# EasyEDA Pro project CogletESP_2026-02-24.epro, board CogletESPV1.1_3
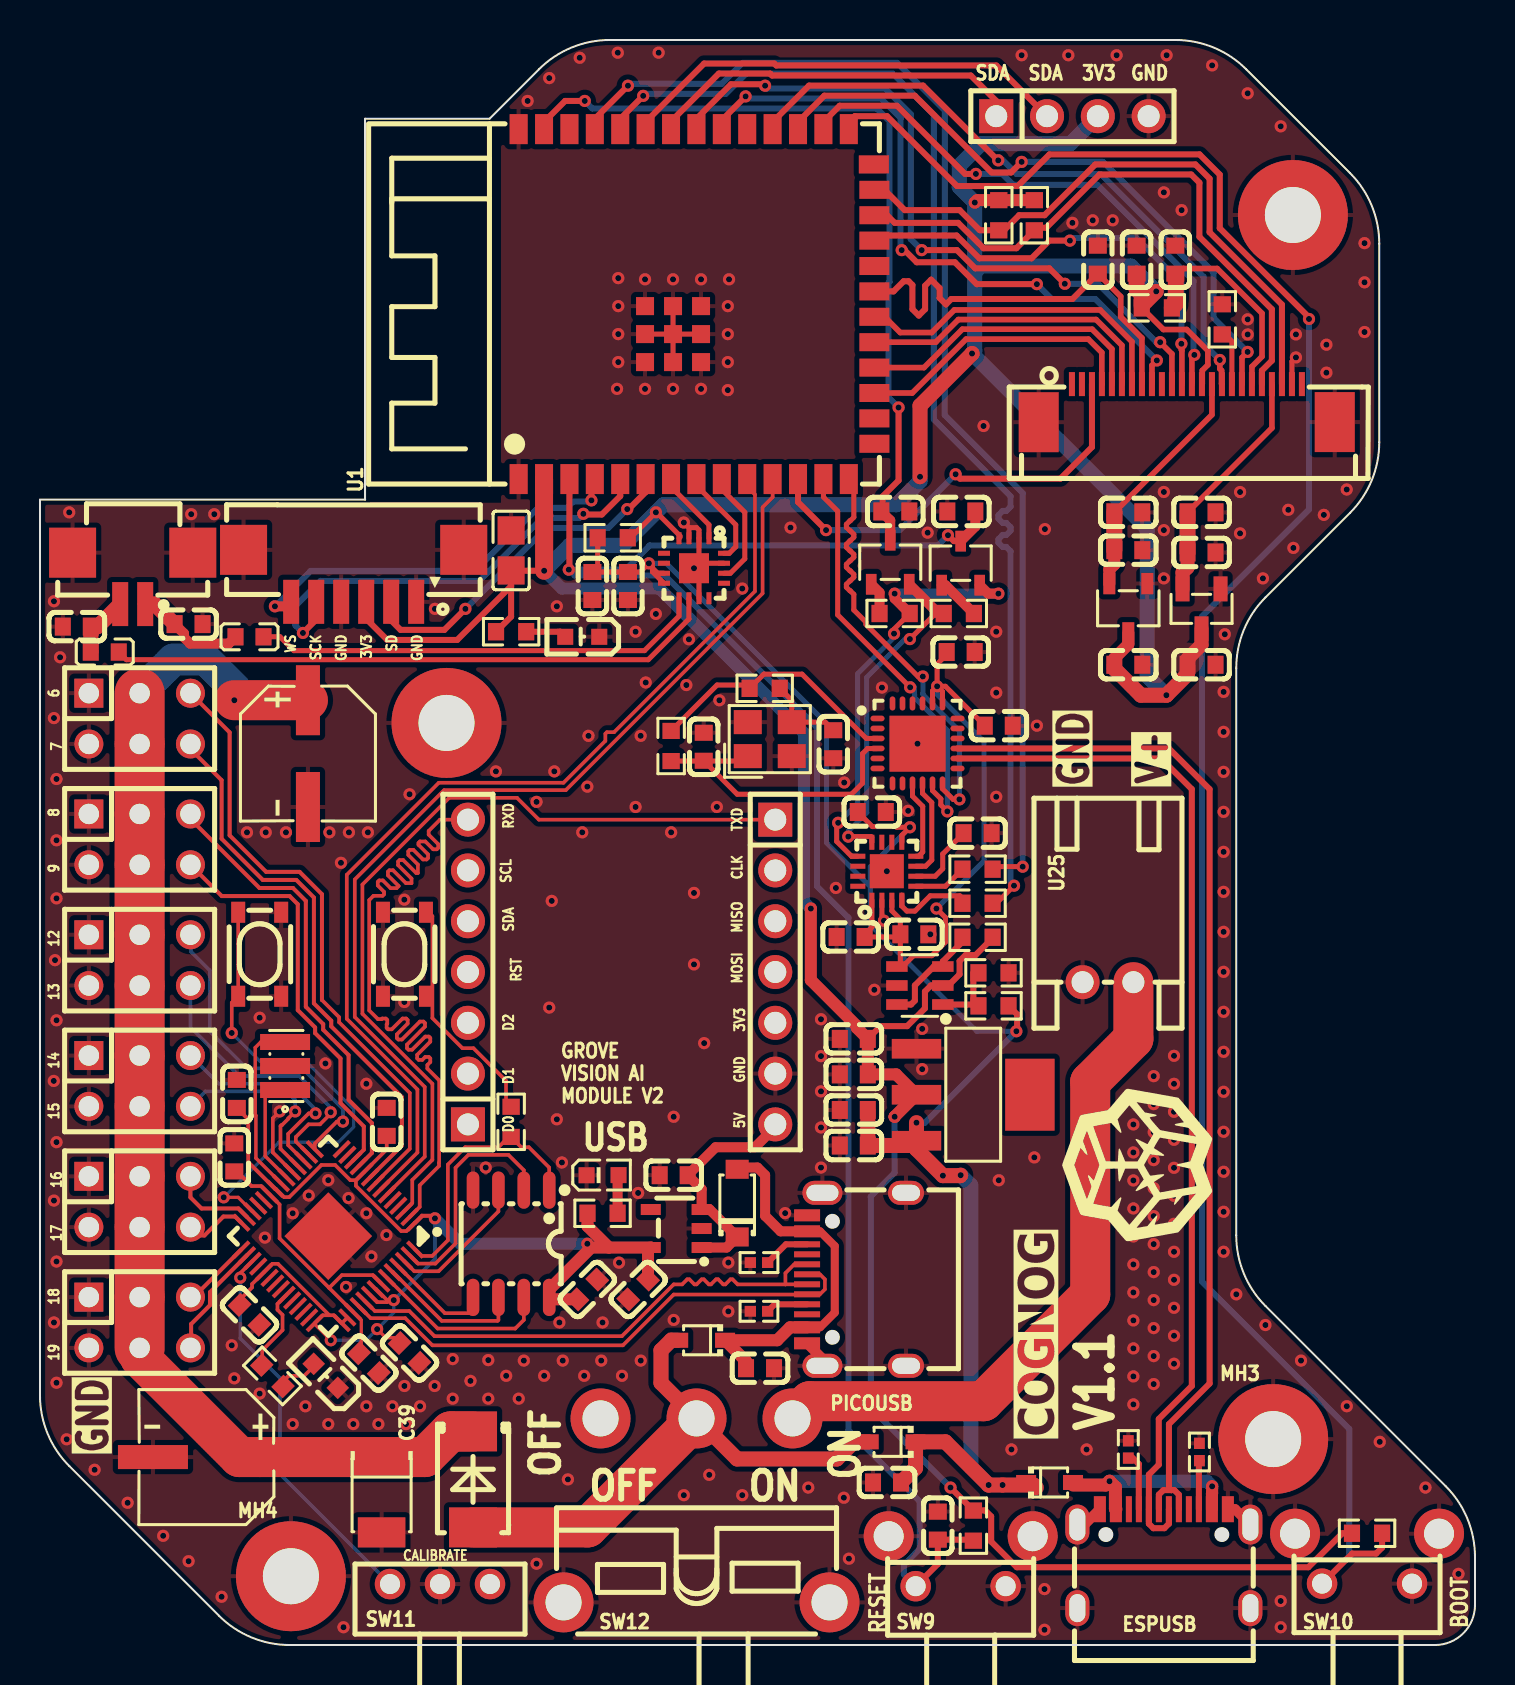
[diagram p11: board, top side]
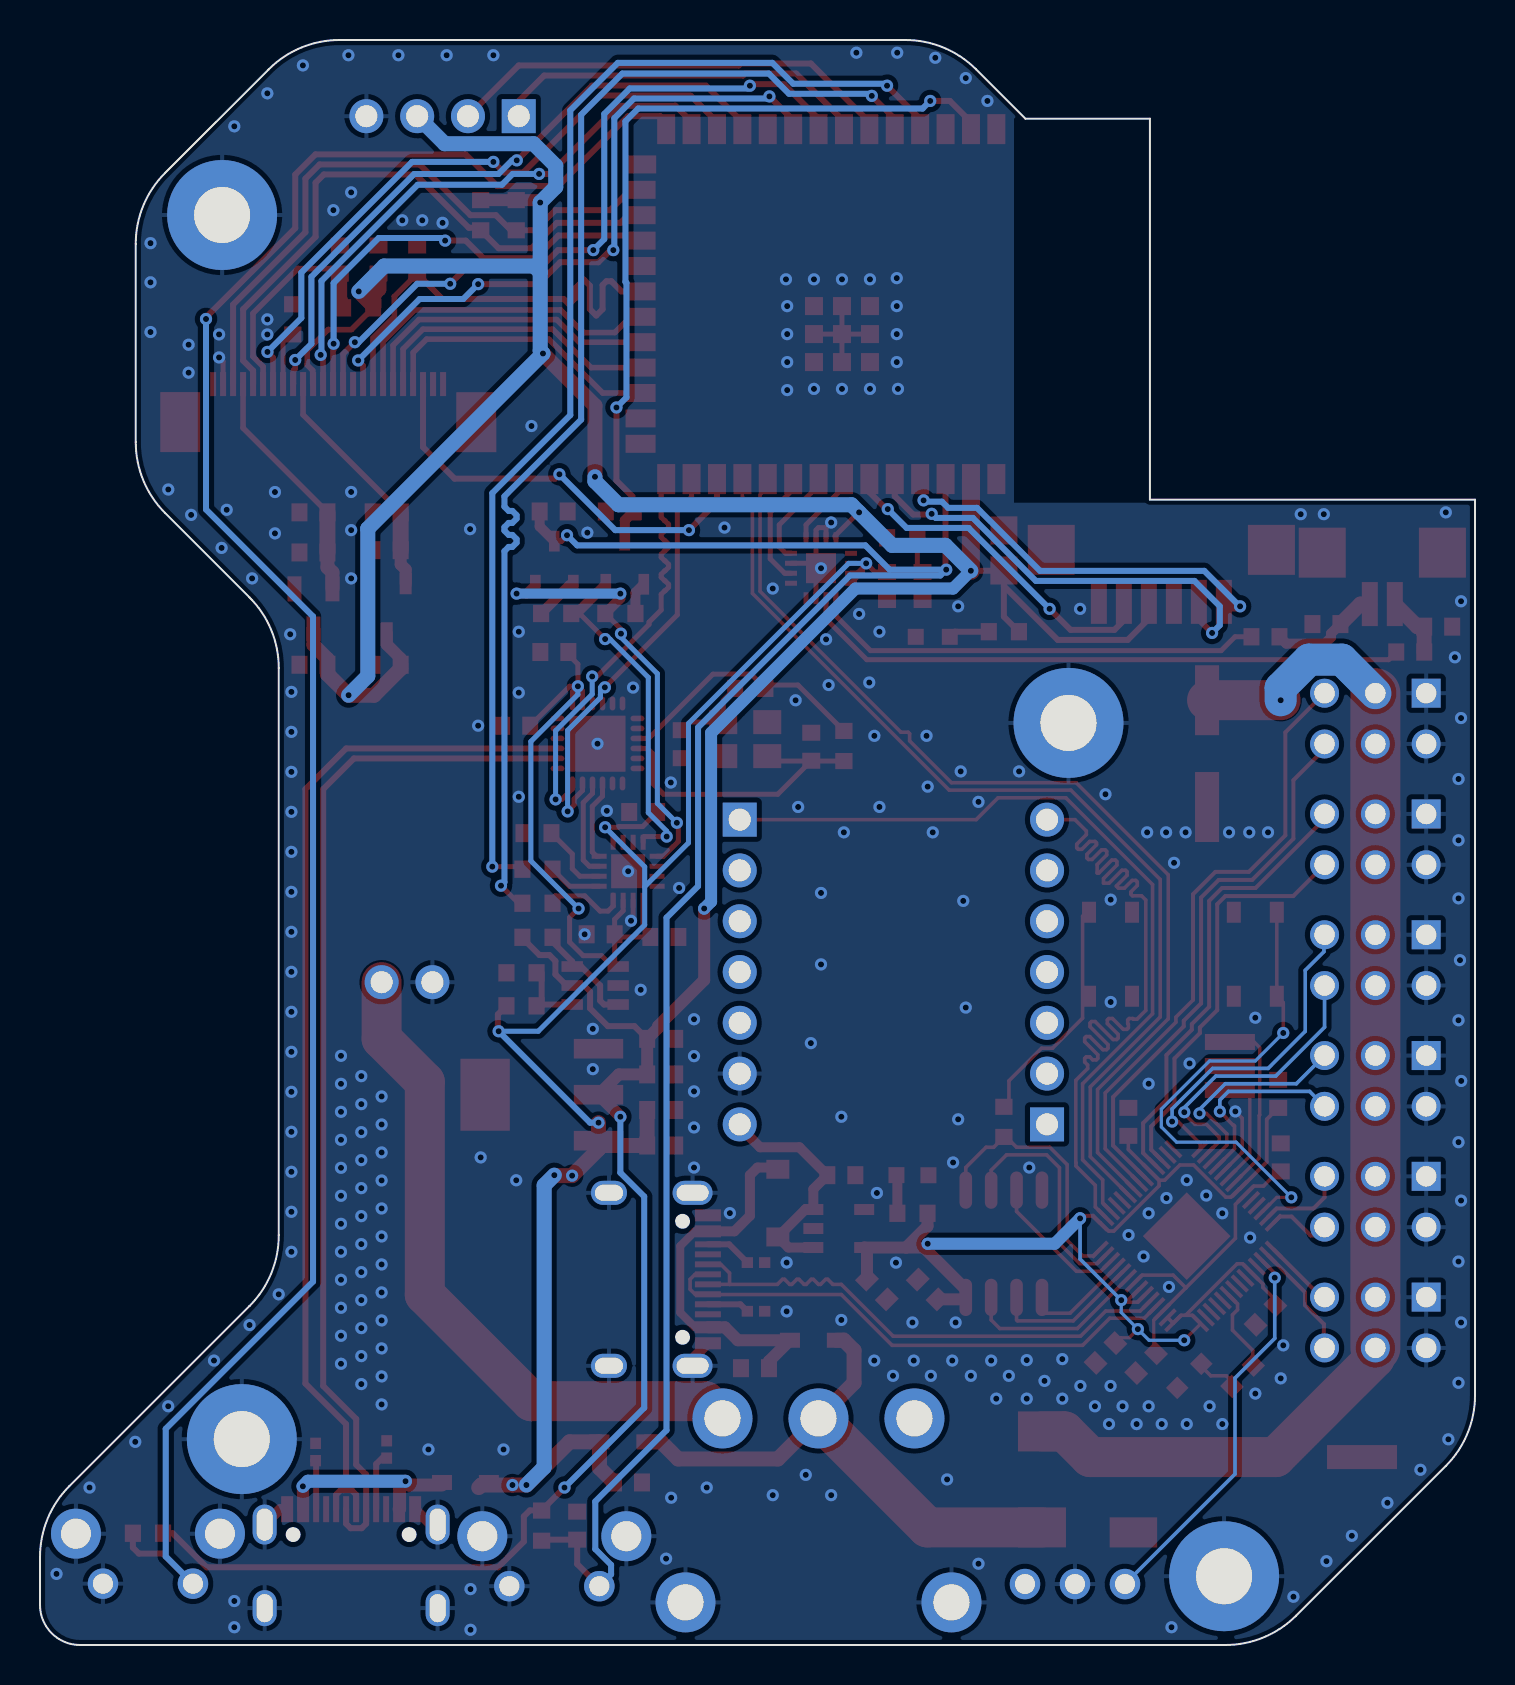
[diagram p12: board, bottom side, seen from below]

Outline 71.76 x 80.26 mm; copper layers: Top Layer, Bottom Layer. Coordinates in mm from the lower left corner of the outline.
Outline path: 0,57.28 16.26,57.28 16.26,76.33 22.48,76.33 24.95,78.8 arc(26.57,79.88) 28.49,80.26 56.78,80.26 arc(58.69,79.88) 60.31,78.8 65.5,73.61 arc(66.59,71.99) 66.97,70.08 66.97,60.15 arc(66.59,58.24) 65.5,56.61 61.28,52.39 arc(60.2,50.77) 59.82,48.86 59.82,20.49 arc(60.2,18.57) 61.28,16.95 70.29,7.94 arc(71.37,6.32) 71.76,4.41 71.76,2 arc(71.17,0.59) 69.76,0 12.48,0 arc(10.57,0.38) 8.95,1.46 1.46,8.95 arc(0.38,10.57) 0,12.48 0,57.28
Stack: Top Layer 0.07mm / Dielectric1 1.51mm FR4 er 4.5 / Bottom Layer 0.07mm

## Design rules (mm)
net EIORX: DP10
net EIOTX: DP10
net EIO17: DP5
net EIO18: DP5
net EIO19: DP9
net EIO20: DP9
net USB_DM: DP1
net USB_DP: DP1
net D_N: DP3
net D_P: DP3
net GPIO0: DP6
net GPIO1: DP6
net CAMPCLK: DP8
net CAMXCLK: DP8
template: Custom Config
spacing copperThickness1oz: track to track 0.102, other pairs 0.152 to 0.3
spacing copperThickness2oz (default): track to track 0.203, other pairs 0.152 to 0.3
track width copperThickness1oz: min 0.127, default 0.254, max 2.54
track width copperThickness2oz (default): min 0.16, default 0.254, max 2.54
differential pair differentialPair (default): width min 0.127, default 0.254, max 2.54; gap min 0.16, default 0.16
via viaSize (default): diameter min 0.5, default 0.61, max 10; hole min 0.3, default 0.305, max 6.3

## Placement (name value [footprint] x y rotation side)
C1  1uF  [C0603]  31.69 23.49 0 top
C2  10uF  [C0603]  42.35 8.13 0 top
C3  220uF  [CAP-SMD_BD6.3-L6.6-W6.6-FD]  8.32 9.4 180 top
C4  1uF  [C0603]  9.84 27.56 270 top
C5  1uF  [C0603]  9.72 24.38 270 top
C6  100nF  [C0603]  18.48 14.6 135 top
C7  100nF  [C0603]  10.48 16.51 135 top
C8  100nF  [C0603]  17.34 26.16 270 top
C9  100nF  [C0603]  16.45 14.1 135 top
C10  10uF  [C0603]  36 13.84 180 top
C11  1uF  [C0603]  29.91 17.78 45 top
C12  1uF  [C0603]  27.37 17.78 225 top
C13  10uF  [C0805]  23.56 54.74 270 top
C14  1uF  [C0603]  44.89 5.97 270 top
C16  1uF  [C0603]  47.94 45.97 180 top
C17  1uF  [C0603]  46.04 49.66 180 top
C18  15pF  [C0603]  33.19 44.92 90 top
C19  15pF  [C0603]  39.67 45.05 270 top
C21  220uF  [CAP-SMD_BD6.3-L6.6-W6.6-FD]  13.4 44.58 270 top
C22  100nF  [C0603]  40.54 35.41 180 top
C23  100nF  [C0603]  43.72 35.54 180 top
C24  100nF  [C0603]  46.88 40.6 180 top
C25  4.7uF  [C0603]  46.07 56.69 0 top
C26  1uF  [C0603]  42.77 56.69 180 top
C27  100nF  [C0603]  40.69 24.98 0 top
C30  100nF  [C0603]  40.69 28.53 0 top
C32  10uF  [C0603]  40.69 26.76 0 top
C33  10uF  [C0603]  40.69 30.31 0 top
C34  10uF  [C0603]  41.59 41.66 180 top
C35  10uF  [C0603]  29.4 52.96 90 top
C36  100nF  [C0603]  27.62 52.96 90 top
C37  220pF  [C0603]  1.84 50.93 0 top
C38  220pF  [C0603]  7.43 51.05 180 top
C39  220uF  [CASE-B_3528]  17.08 7.49 270 top
C40  15pF  [C0603]  52.9 69.28 270 top
C41  100nF  [C0603]  54.83 69.28 270 top
C42  100nF  [C0603]  56.77 69.28 270 top
C43  100nF  [C0603]  58.08 56.64 180 top
C44  10uF  [C0603]  58.08 54.64 180 top
C45  100nF  [C0603]  58.08 49.02 180 top
C46  100nF  [C0603]  54.42 54.75 0 top
C47  10uF  [C0603]  54.42 56.64 0 top
C48  10uF  [C0603]  54.42 49.02 0 top
CN1  HC-1.25-2PWT  [CONN-SMD_2P-P1.25-HC-1.25-2PWT]  4.64 53.34 180 top
CN4  HC-1.25-6PWT  [CONN-SMD_6P-P1.25_HC-1.25-6PWT]  15.68 53.47 180 top
D1  DSK34  [SOD-123_L2.8-W1.8-LS3.7-RD]  34.86 22.1 90 top
D2  B5819WS  [SOD-323_L1.8-W1.3-LS2.5-RD]  42.61 10.16 180 top
D3  B5819WS  [SOD-323_L1.8-W1.3-LS2.5-RD]  50.48 8.13 0 top
D6  B5819WS  [SOD-323_L1.8-W1.3-LS2.5-RD]  33.08 15.24 180 top
D7  SS1045-SMB  [SMB_L4.4-W3.6-LS5.3-RD]  21.65 8.28 270 top
ESPUSB  TYPE-C-31-M-12  [USB-C_SMD-TYPE-C-31-M-12_1]  56.2 4.32 0 top
FPC3  AFC07-S24FCA-00  [FPC-SMD_AFC07-S24FCA-00]  57.34 62.1 0 top
H8  PZ254V-11-04P  [HDR-TH_4P-P2.54-V-M]  51.63 76.45 0 top
L1  BLM18PG121SN1D  [L0603]  10.48 50.42 0 top
L2  BLM18PG121SN1D  [L0603]  3.24 49.66 0 top
LED1  SML-D12P8WT86  [LED0603-RD_GREEN]  28.13 23.49 0 top
LED2  SML-D12D8WT86  [LED0603-R-RD_AMBER]  14.29 13.46 135 top
LED3  SML-D12D8WT86  [LED0603-R-RD_AMBER]  27.11 50.42 180 top
MH1  -  [2.5mm Mounting Hole]  20.33 46.11 0 top
MH2  -  [2.5mm Mounting Hole]  62.65 71.51 0 top
MH3  -  [2.5mm Mounting Hole]  61.66 10.3 0 top
MH4  -  [2.5mm Mounting Hole]  12.55 3.44 0 top
PICOUSB  TYPE-C-31-M-12  [USB-C_SMD-TYPE-C-31-M-12_1]  40.83 18.29 90 top
Q1  FDC6333C  [SOT-23-6_L2.9-W1.6-P0.95-LS2.8-BL]  44 32.98 90 top
Q2  S8050  [SOT-23-3_L3.0-W1.7-P0.95-LS2.9-BR]  42.52 54.15 270 top
Q3  S8050  [SOT-23-3_L3.0-W1.7-P0.95-LS2.9-BR]  46.04 54.1 270 top
R7  1kΩ  [R0603]  11.62 13.46 135 top
R8  1kΩ  [R0603]  28.13 21.59 180 top
R9  1kΩ  [R0603]  23.56 26.16 270 top
R11  5.1kΩ  [R0402]  35.95 16.69 0 top
R12  5.1kΩ  [R0402]  35.95 19.12 0 top
R13  10kΩ  [R0603]  46.67 5.97 90 top
R14  10kΩ  [R0603]  66.36 5.59 180 top
R15  100kΩ  [R0603]  47.68 31.96 180 top
R16  100kΩ  [R0603]  47.68 33.61 0 top
R17  100kΩ  [R0603]  46.88 35.39 180 top
R18  1kΩ  [R0603]  36.24 47.84 180 top
R19  1kΩ  [R0603]  31.56 44.96 270 top
R21  10kΩ  [R0603]  23.56 50.67 180 top
R22  0Ω  [R0603]  46.88 37.09 180 top
R23  0Ω  [R0603]  46.88 38.8 180 top
R24  12kΩ  [R0603]  45.94 51.58 180 top
R25  12kΩ  [R0603]  42.74 51.58 0 top
R26  5.1kΩ  [R0402]  54.42 9.78 270 top
R27  5.1kΩ  [R0402]  57.98 9.65 270 top
R28  1MΩ  [R0603]  28.64 55.37 180 top
R30  4.7kΩ  [R0603]  55.84 66.87 180 top
R31  4.7kΩ  [R0603]  49.72 71.5 90 top
R32  4.7kΩ  [R0603]  47.94 71.5 90 top
R33  1kΩ  [R0603]  59.12 66.29 90 top
SW1  SKRPACE010  [KEY-SMD_4P-L4.2-W3.2-P2.20-LS4.6]  18.22 34.54 270 top
SW2  SKRPACE010  [KEY-SMD_4P-L4.2-W3.2-P2.20-LS4.6]  10.99 34.54 90 top
SW9  TC-6615-9.5-260G  [SW-TH_4P-L7.5-W9.5-P4.50]  46.04 4.19 180 top
SW10  TC-6615-9.5-260G  [SW-TH_4P-L7.5-W9.5-P4.50]  66.36 4.32 180 top
SW11  MK-12D13G4-B  [SW-TH_MK-12D13G4-B]  20 3.05 0 top
SW12  SS-12D11G5R  [SW-TH_SS-12D11G5R]  32.83 6.73 180 top
U1  ESP32-S3-WROOM-1-N16R8  [WIRELM-SMD_ESP32-S3-WROOM-1]  32.83 67.06 90 top
U2  HX PZ2.54-3x2P ZZ  [HDR-TH_6P-P2.54-V-M-R3-C2-S2.54_2]  4.98 40.29 270 top
U4  HX PZ2.54-3x2P ZZ  [HDR-TH_6P-P2.54-V-M-R3-C2-S2.54_2]  4.98 28.21 270 top
U5  HX PZ2.54-3x2P ZZ  [HDR-TH_6P-P2.54-V-M-R3-C2-S2.54_2]  4.98 34.25 270 top
U6  W25Q16JVSNIQ  [SOP-8_L4.9-W3.9-P1.27-LS6.0-BL]  23.56 20.07 180 top
U7  RP2040  [LQFN-56_L7.0-W7.0-P0.4-EP]  14.41 20.45 225 top
U8  MIC5504-3.3YM5-TR  [SOT-23-5_L3.0-W1.7-P0.95-LS2.8-TL]  31.81 20.83 180 top
U11  CH334F  [QFN-24_L4.0-W4.0-P0.50-BL-EP2.8]  43.88 45.08 270 top
U12  12MHz  [CRYSTAL-SMD_4P-L3.2-W2.5-BL]  36.49 45.3 0 top
U14  CH343P  [TQFN-16_L3.0-W3.0-P0.50-BL-EP1.7]  42.34 38.69 0 top
U15  AMS1117-3.3  [SOT-223-4_L6.5-W3.5-P2.30-LS7.0-BR]  46.66 27.52 180 top
U16  MAX98357AETE+T  [TQFN-16_L3.0-W3.0-P0.50-BL-EP1.5]  32.7 53.85 180 top
U18  HB-PH3-25417PB2GOP  [HDR-TH_7P-P2.54-V-M]  21.4 33.65 90 top
U20  HB-PH3-25417PB2GOP  [HDR-TH_7P-P2.54-V-M]  36.77 33.65 270 top
U22  HX PZ2.54-3x2P ZZ  [HDR-TH_6P-P2.54-V-M-R3-C2-S2.54_2]  4.98 46.33 270 top
U23  HX PZ2.54-3x2P ZZ  [HDR-TH_6P-P2.54-V-M-R3-C2-S2.54_2]  4.98 16.13 270 top
U24  HX PZ2.54-3x2P ZZ  [HDR-TH_6P-P2.54-V-M-R3-C2-S2.54_2]  4.98 22.17 270 top
U25  S2B-XH-A-BK(LF)(SN)  [CONN-TH_S2B-XH-A-LF-SN]  53.4 33.15 0 top
U26  XC6206P282MR  [SOT-23-3_L2.9-W1.3-P0.95-LS2.4-BR]  58.08 51.82 90 top
U28  SSP7615-12MR  [SOT-23-3_L2.9-W1.6-P1.90-LS2.8-BR]  54.42 51.85 90 top
X1  12MHz  [CRYSTAL-SMD_3P-L3.2-W1.3-P1.2-BL]  12.26 28.96 90 top

## Footprints (pads in the part's own frame, mm; a bottom-side part is the same pattern mirrored in y, then rotated)
2.5mm Mounting Hole
  round 5.5 hole 2.8: 1(0,0)
C0603
  rect 0.8x0.9 smd: 1(-0.7,0) 2(0.7,0)
C0805
  rect 1.41x1.35 smd: 1(-1,0) 2(1,0)
CAP-SMD_BD6.3-L6.6-W6.6-FD
  rect 3.5x1.2 smd: 1(-2.67,0) 2(2.67,0)
CASE-B_3528
  rect 1.506x2.376 smd: 1(-1.861,0) 2(1.861,0)
CONN-SMD_2P-P1.25-HC-1.25-2PWT
  rect 0.8x2.2 smd: 1(-0.625,1.285) 2(0.625,1.285)
  rect 2.35x2.5 smd: 3(-3.005,-1.285) 4(3.005,-1.285)
CONN-SMD_6P-P1.25_HC-1.25-6PWT
  rect 0.8x2.2 smd: 1(-3.125,1.3) 2(-1.875,1.3) 3(-0.625,1.3) 4(0.625,1.3) 5(1.875,1.3) 6(3.125,1.3)
  rect 2.35x2.5 smd: 7(-5.505,-1.3) 8(5.505,-1.3)
CONN-TH_S2B-XH-A-LF-SN
  round 1.7 hole 1.1: 1(1.27,0) 2(-1.27,0)
CRYSTAL-SMD_3P-L3.2-W1.3-P1.2-BL
  rect 0.8x2.5 smd: 1(-1.2,0) 2(0,0) 3(1.2,0)
CRYSTAL-SMD_4P-L3.2-W2.5-BL
  rect 1.4x1.2 smd: 1(-1.1,-0.85) 2(1.1,-0.85) 3(1.1,0.85) 4(-1.1,0.85)
FPC-SMD_AFC07-S24FCA-00
  rect 0.3x1.2 smd: 1(-5.74,0.953) 2(-5.239,0.953) 3(-4.739,0.953) 4(-4.242,0.953) 5(-3.741,0.953) 6(-3.24,0.953) 7(-2.74,0.953) 8(-2.24,0.953) 9(-1.74,0.953) 10(-1.24,0.953) 11(-0.74,0.953) 12(-0.241,0.953) 13(0.26,0.953) 14(0.76,0.953) 15(1.26,0.953) 16(1.76,0.953) 17(2.26,0.953) 18(2.759,0.953) 19(3.26,0.953) 20(3.76,0.953) 21(4.26,0.953) 22(4.761,0.953) 23(5.261,0.953) 24(5.76,0.953)
  rect 2x3 smd: 25(-7.401,-0.953) 26(7.401,-0.947)
HDR-TH_4P-P2.54-V-M
  rect 1.7x1.7 hole 1.1: 1(-3.81,0)
  round 1.7 hole 1.1: 2(-1.27,0) 3(1.27,0) 4(3.81,0)
HDR-TH_6P-P2.54-V-M-R3-C2-S2.54_2
  round 1.45 hole 1.02: 1(1.27,2.54) 2(-1.27,2.54) 3(-1.27,0) 4(1.27,0) 5(1.27,-2.54)
  rect 1.45x1.45 hole 1.02: 6(-1.27,-2.54)
HDR-TH_7P-P2.54-V-M
  rect 1.7x1.7 hole 1.1: 1(-7.62,0)
  round 1.7 hole 1.1: 2(-5.08,0) 3(-2.54,0) 4(0,0) 5(2.54,0) 6(5.08,0) 7(7.62,0)
KEY-SMD_4P-L4.2-W3.2-P2.20-LS4.6
  rect 1.05x0.7 smd: 1(-2.1,1.075) 2(2.1,1.075) 3(-2.1,-1.075) 4(2.1,-1.075)
L0603
  rect 0.8x0.864 smd: 1(-0.7,0) 2(0.7,0)
LED0603-R-RD_AMBER
  rect 0.8x0.8 smd: 1(0.851,0) 2(-0.851,0)
LED0603-RD_GREEN
  rect 0.8x0.8 smd: 1(-0.799,-0.004) 2(0.799,0.004)
LQFN-56_L7.0-W7.0-P0.4-EP
  rect 1.1x0.2 smd: 1(-3.55,2.6) 2(-3.55,2.2) 3(-3.55,1.8) 4(-3.55,1.4) 5(-3.55,1) 6(-3.55,0.6) 7(-3.55,0.2) 8(-3.55,-0.2) 9(-3.55,-0.6) 10(-3.55,-1) 11(-3.55,-1.4) 12(-3.55,-1.8) 13(-3.55,-2.2) 14(-3.55,-2.6) 29(3.55,-2.6) 30(3.55,-2.2) 31(3.55,-1.8) 32(3.55,-1.4) 33(3.55,-1) 34(3.55,-0.6) 35(3.55,-0.2) 36(3.55,0.2) 37(3.55,0.6) 38(3.55,1) 39(3.55,1.4) 40(3.55,1.8) 41(3.55,2.2) 42(3.55,2.6)
  rect 0.2x1.1 smd: 15(-2.6,-3.55) 16(-2.2,-3.55) 17(-1.8,-3.55) 18(-1.4,-3.55) 19(-1,-3.55) 20(-0.6,-3.55) 21(-0.2,-3.55) 22(0.2,-3.55) 23(0.6,-3.55) 24(1,-3.55) 25(1.4,-3.55) 26(1.8,-3.55) 27(2.2,-3.55) 28(2.6,-3.55) 43(2.6,3.55) 44(2.2,3.55) 45(1.8,3.55) 46(1.4,3.55) 47(1,3.55) 48(0.6,3.55) 49(0.2,3.55) 50(-0.2,3.55) 51(-0.6,3.55) 52(-1,3.55) 53(-1.4,3.55) 54(-1.8,3.55) 55(-2.2,3.55) 56(-2.6,3.55)
  rect 3.1x3.1 smd: 57(0,0)
QFN-24_L4.0-W4.0-P0.50-BL-EP2.8
  oval 0.28x0.7 smd: 1(-1.25,-2) 2(-0.75,-2) 3(-0.25,-2) 4(0.25,-2) 5(0.75,-2) 6(1.25,-2) 13(1.25,2) 14(0.75,2) 15(0.25,2) 16(-0.25,2) 17(-0.75,2) 18(-1.25,2)
  oval 0.7x0.28 smd: 7(2,-1.25) 8(2,-0.75) 9(2,-0.25) 10(2,0.25) 11(2,0.75) 12(2,1.25) 19(-2,1.25) 20(-2,0.75) 21(-2,0.25) 22(-2,-0.25) 23(-2,-0.75) 24(-2,-1.25)
  rect 2.8x2.8 smd: 25(0.013,0)
R0402
  rect 0.566x0.54 smd: 1(-0.433,0) 2(0.433,0)
R0603
  rect 0.806x0.864 smd: 1(-0.753,0) 2(0.753,0)
SMB_L4.4-W3.6-LS5.3-RD
  rect 2x2.4 smd: 1(-2.4,0) 2(2.4,0)
SOD-123_L2.8-W1.8-LS3.7-RD
  rect 0.95x1.15 smd: 1(-1.692,0) 2(1.692,0)
SOD-323_L1.8-W1.3-LS2.5-RD
  rect 1x0.75 smd: 1(-1.173,0) 2(1.173,0)
SOP-8_L4.9-W3.9-P1.27-LS6.0-BL
  oval 0.63x1.865 smd: 1(-1.905,-2.683) 2(-0.635,-2.683) 3(0.635,-2.683) 4(1.905,-2.683) 5(1.905,2.683) 6(0.635,2.683) 7(-0.635,2.683) 8(-1.905,2.683)
SOT-23-3_L2.9-W1.3-P0.95-LS2.4-BR
  rect 1.25x0.7 smd: 1(1,-0.95) 2(1,0.95) 3(-1,0)
SOT-23-3_L2.9-W1.6-P1.90-LS2.8-BR
  rect 1.07x0.6 smd: 1(1.235,-0.95) 2(1.235,0.95) 3(-1.235,0)
SOT-23-3_L3.0-W1.7-P0.95-LS2.9-BR
  rect 1.038x0.532 smd: 1(1.101,-0.95) 2(1.101,0.95) 3(-1.101,0)
SOT-23-5_L3.0-W1.7-P0.95-LS2.8-TL
  rect 1x0.55 smd: 1(-1.272,0.95) 2(-1.272,0) 3(-1.272,-0.95) 4(1.272,-0.95) 5(1.272,0.95)
SOT-23-6_L2.9-W1.6-P0.95-LS2.8-BL
  rect 0.532x1.072 smd: 1(-0.95,-1.149) 2(0,-1.149) 3(0.95,-1.149) 4(0.95,1.149) 5(0,1.149) 6(-0.95,1.149)
SOT-223-4_L6.5-W3.5-P2.30-LS7.0-BR
  rect 2.47x0.98 smd: 1(2.835,-2.3) 2(2.835,0) 3(2.835,2.3)
  rect 2.47x3.6 smd: 4(-2.835,0)
SW-TH_4P-L7.5-W9.5-P4.50
  round 1.524 hole 1: 1(-2.25,1.25) 2(2.25,1.25)
  round 2.5 hole 1.5: 3(-3.6,-1.25) 4(3.6,-1.25)
SW-TH_MK-12D13G4-B
  round 1.524 hole 1: 1(-2.5,0) 2(0,0) 3(2.5,0)
SW-TH_SS-12D11G5R
  round 3 hole 1.8: 1(-4.8,-4.6) 2(0,-4.6) 3(4.8,-4.6) 4(6.65,4.6) 5(-6.65,4.6)
TQFN-16_L3.0-W3.0-P0.50-BL-EP1.5
  rect 0.25x0.6 smd: 1(-0.749,-1.5) 2(-0.248,-1.5) 3(0.252,-1.5) 4(0.751,-1.5) 9(0.75,1.5) 10(0.25,1.5) 11(-0.25,1.5) 12(-0.749,1.5)
  rect 0.6x0.25 smd: 5(1.5,-0.748) 6(1.5,-0.248) 7(1.5,0.252) 8(1.5,0.752) 13(-1.5,0.752) 14(-1.5,0.252) 15(-1.5,-0.248) 16(-1.5,-0.748)
  rect 1.5x1.5 smd: 17(0,0)
TQFN-16_L3.0-W3.0-P0.50-BL-EP1.7
  rect 0.25x0.75 smd: 1(-0.749,-1.45) 2(-0.248,-1.45) 3(0.252,-1.45) 4(0.751,-1.45) 9(0.75,1.45) 10(0.25,1.45) 11(-0.25,1.45) 12(-0.749,1.45)
  rect 0.75x0.25 smd: 5(1.45,-0.75) 6(1.45,-0.25) 7(1.45,0.25) 8(1.45,0.75) 13(-1.45,0.75) 14(-1.45,0.25) 15(-1.45,-0.25) 16(-1.45,-0.75)
  rect 1.7x1.7 smd: 17(0.001,0)
USB-C_SMD-TYPE-C-31-M-12_1
  oval 1.2x2 hole 0.8x1.6: 1(4.325,1.706) 4(-4.325,1.706)
  oval 1.2x1.8 hole 0.8x1.4: 2(4.325,-2.474) 3(-4.325,-2.474)
  custom 0.6x1.3 smd: A1B12(-3.2,2.474) A4B9(-2.4,2.474) B1A12(3.2,2.474) B4A9(2.401,2.474)
  rect 0.3x1.3 smd: A5(-1.25,2.474) A6(-0.25,2.474) A7(0.25,2.474) A8(1.25,2.474) B5(1.75,2.474) B6(0.75,2.474) B7(-0.75,2.474) B8(-1.75,2.474)
WIRELM-SMD_ESP32-S3-WROOM-1
  rect 1.5x0.9 smd: 1(-8.75,8.895) 2(-8.75,7.625) 3(-8.75,6.355) 4(-8.75,5.085) 5(-8.75,3.815) 6(-8.75,2.545) 7(-8.75,1.275) 8(-8.75,0.005) 9(-8.75,-1.265) 10(-8.75,-2.535) 11(-8.75,-3.805) 12(-8.75,-5.075) 13(-8.75,-6.345) 14(-8.75,-7.615) 27(8.75,-7.615) 28(8.75,-6.345) 29(8.75,-5.075) 30(8.75,-3.805) 31(8.75,-2.535) 32(8.75,-1.265) 33(8.75,0.005) 34(8.75,1.275) 35(8.75,2.545) 36(8.75,3.815) 37(8.75,5.085) 38(8.75,6.355) 39(8.75,7.625) 40(8.75,8.895)
  rect 0.9x1.5 smd: 15(-6.985,-8.895) 16(-5.715,-8.895) 17(-4.445,-8.895) 18(-3.175,-8.895) 19(-1.905,-8.895) 20(-0.635,-8.895) 21(0.635,-8.895) 22(1.905,-8.895) 23(3.175,-8.895) 24(4.445,-8.895) 25(5.715,-8.895) 26(6.985,-8.865)
  rect 0.9x0.9 smd: 41(-2.9,2.575) 41(-2.9,1.175) 41(-2.9,-0.225) 41(-1.5,2.575) 41(-1.5,1.175) 41(-1.5,-0.225) 41(-0.1,2.575) 41(-0.1,1.175) 41(-0.1,-0.225)

## Nets
As in the schematic.

Pads without a net: ESPUSB A8 B8; FPC3 1 2 24; PICOUSB A8 B8; SW11 3; SW12 3; U7 35 36 41; U8 4; U11 1 2 5 6 7 8 13 16 17 18 21 22 23 24; U14 10 11 14 15 16; U15 4; U16 5 6 12 13

## Via types
v1: diameter 0.61, hole 0.305, Top Layer to Bottom Layer, 342 vias

## Routing (per net, layer and track width the routed paths; a pad name or vN(x,y) marks a point on that pad's centre or on a via; arc(x,y) is an arc through that point)
1.2V: length 12.1
  Top Layer w0.28: C47.1 58.6,61.52 FPC3.15
  Top Layer w0.6: C46.1 53.72,54.04 53.47,53.79 U28.2
  Top Layer w0.8: C46.1 C47.1
1V1: length 14.9
  Top Layer w0.16: U7.45 16.07,16.25 16.07,14.92 15.95,14.81 15.95,14.72
  Top Layer w0.18: 14.46,17.86 11.98,20.34 11.98,22.03 U7.23 11.06,22.95 10.57,22.95 9.84,23.68 ; 14.46,17.86 15.1,18.5 16.65,18.5 17.07,18.08 ; 14.46,17.86 U7.45
2.8V: length 12.1
  Top Layer w0.28: FPC3.21 61.6,60.86 C43.2
  Top Layer w0.7: U26.2 57.13,53.64 57.38,53.89 C44.2
  Top Layer w0.8: C43.2 C44.2
3V3: length 60.8
  Top Layer w0.16: v1(16.86,15.8) 17.29,15.37 17.72,15.37 C6.2 ; 13.74,16.1 13.74,16.04 v1(14.54,15.24)
  Top Layer w0.18: U7.48 16.87,17.14 17.36,17.14 17.36,17.25 ; 17.36,17.25 16.81,17.8 U7.49 ; 17.36,17.25 v1(17.69,17.25) ; 9.98,17.26 10.6,17.88 10.6,18.05 U7.33 11.62,19.06 11.9,19.06 14.45,16.51 14.45,16.49 ; U7.22 11.79,22.82 12.21,22.4 12.46,22.4 14.07,24 14.76,24 15.52,23.25 15.8,23.25 ; C8.2 17.34,24.78 U7.10 15.8,23.25 ; 14.45,16.49 14.69,16.49 15.09,16.1 15.1,16.1 15.37,16.37 U7.44 ; 14.45,16.49 14.14,16.49 U7.42 ; 15.8,23.25 15.8,22.96 18.06,20.7 18.32,20.7 18.74,21.12 U7.1
  Top Layer w0.19: C4.2 10.41,26.29 10.41,24.15 11.75,22.82 U7.22
  Top Layer w0.2: U7.1 19.11,21.46 19.62,21.46 v1(19.75,21.34)
  Top Layer w0.6: 28.45,19.88 27.56,19.88 25.46,17.78 U6.8 25.56,17.28 C12.2 ; 28.45,19.88 U8.5 30.4,19.74 C11.2 ; 28.45,19.88 27.38,20.95 R8.2
  Bottom Layer w0.16: v1(17.69,17.25) 17.69,16.63 v1(16.86,15.8) 16.3,15.24 v1(14.54,15.24)
  Bottom Layer w0.18: v1(19.75,21.34) 19.75,19.3 v1(17.69,17.25)
  Bottom Layer w0.6: v1(27.37,20.07) 21.02,20.07 v1(19.75,21.34)
3V3_OP: length 32.2
  Top Layer w0.25: 43.02,35.54 43.02,34.1 Q1.4 43.14,33.93 43.68,34.47 44.59,34.47 45.28,35.15 45.28,36.38 v1(44.83,36.83) ; 43.02,35.54 42.89,35.41 C22.1 ; 43.02,35.54 43.02,36.29 42.6,36.71 U14.3 ; U14.1 41.6,35.9 41.24,35.53 ; U11.20 44.63,47.71 v1(44.86,47.94) ; v1(44.86,47.94) 45.13,47.68 U11.19 ; v1(44.86,47.94) 45.27,47.94 C16.2 ; v1(44.86,47.94) 44.86,49.05 45.34,49.53 C17.2
  Bottom Layer w0.25: v1(44.83,36.83) 47.21,39.21 47.21,45.18 44.86,47.53 v1(44.86,47.94)
GND: length 22.3
  Top Layer w0.18: v1(11.98,26.68) 11.64,26.34 11.64,24.63 U7.19
  Top Layer w0.25: U1.41 U1.41 ; U1.41 U1.41 ; U1.41 U1.41 ; U1.41 31.65,66.96 ; 32.45,55.88 v1(32.19,56.13) ; 32.45,55.88 U16.3 ; 32.45,55.88 32.83,55.88 32.95,55.76 U16.2 32.95,54.1 ; v1(42.2,36.22) 42.1,36.33 U14.2 ; 34.2,54.1 32.95,54.1 v1(32.7,53.85) 32.95,53.6 U16.11 ; FPC3.23 62.6,64.19 v1(62.8,64.39)
  Top Layer w0.5: ESPUSB.1 59.75,6.79 ESPUSB.B1A12 ; ESPUSB.A1B12 52.23,6.02 51.87,6.02 ; PICOUSB.4 39.12,14.32 PICOUSB.A1B12
  vias: v1(0.69,28.21) v1(0.7,52.2) v1(0.7,46.35) v1(0.75,34.25) v1(0.7,22.22) v1(0.7,16.13) v1(0.83,43.31) v1(0.83,40.24) v1(0.83,37.34) v1(0.83,31.24) v1(0.83,25.15) v1(0.83,19.18) v1(0.83,13.11) v1(1.01,49.39) v1(1.33,10.29) v1(1.46,56.64) v1(2.73,8.76) v1(4.38,7.11) v1(6.16,5.46) v1(7.43,4.19) v1(7.56,56.55) v1(8.72,56.55) v1(9.08,2.41) v1(9.59,14.99) v1(9.72,13.33) v1(10.35,40.64) v1(10.99,31.37) v1(10.99,12.57) v1(11.29,40.64) v1(11.25,20.37) v1(12.3,40.64) v1(12.64,21.59) v1(12.64,11.05) v1(13.27,11.94) v1(13.44,22.48) v1(14.27,29.08) v1(14.47,40.64) v1(14.41,23.25) v1(14.41,11.05) v1(15.05,39.12) v1(15.18,0.89) v1(15.3,17.91) v1(15.45,40.64) v1(15.43,22.35) v1(15.67,11.05) v1(16.32,28.07) v1(16.32,21.59) v1(16.32,11.94) v1(16.4,40.64) v1(16.57,19.43) v1(16.92,11.05) v1(17.32,20.5) v1(17.62,11.94) v1(18.22,37.27) v1(18.22,32.15) v1(18.22,12.95) v1(18.3,11.05) v1(18.48,42.54) v1(19.01,11.94) v1(19.75,51.82) v1(19.73,12.95) v1(20.64,14.3) v1(20.64,12.32) v1(21.53,13.21) v1(22.29,23.88) v1(22.42,14.25) v1(22.42,12.32) v1(22.8,43.69) v1(23.31,13.46) v1(23.94,12.32) v1(24.19,14.22) v1(24.38,77.22) v1(24.83,42.16) v1(24.83,4.06) v1(25.21,13.46) v1(25.46,78.36) v1(25.46,31.88) v1(25.59,37.21) v1(25.72,43.69) v1(25.84,51.94) v1(25.84,26.29) v1(25.97,16.13) v1(26.1,24.13) v1(26.14,14.22) v1(26.4,8.28) v1(26.99,79.37) v1(27.11,40.64) v1(27.21,13.46) v1(27.37,42.93) v1(27.43,45.47) v1(28.06,14.22) v1(28.13,16.13) v1(28.89,79.63) v1(28.85,62.82) v1(28.92,68.36) v1(28.92,66.96) v1(28.92,65.56) v1(28.92,64.16) v1(28.95,19.12) v1(29.1,13.46) v1(29.78,50.67) v1(29.78,41.91) v1(29.91,22.61) v1(30.04,45.47) v1(30.04,14.22) v1(30.25,68.3) v1(30.25,62.82) v1(30.29,48.13) v1(30.8,51.56) v1(30.93,79.63) v1(31.56,40.64) v1(31.65,68.3) v1(31.65,62.82) v1(31.69,26.42) v1(31.69,16.26) v1(32.19,7.49) v1(32.32,48.01) v1(32.45,50.29) v1(32.7,37.61) v1(32.7,34.04) v1(33.05,68.3) v1(33.05,62.82) v1(33.21,30.1) v1(33.46,8.51) v1(33.85,41.91) v1(33.97,47.24) v1(34.45,68.3) v1(34.39,66.96) v1(34.39,65.56) v1(34.39,64.16) v1(34.39,62.76) v1(34.42,19.12) v1(34.42,16.68) v1(35.12,52.83) v1(35.12,7.49) v1(37.26,21.6) v1(37.53,55.88) v1(38.42,7.87) v1(39.05,31.29) v1(39.05,29.45) v1(39.05,27.69) v1(39.05,25.88) v1(39.05,23.88) v1(39.8,37.86) v1(40.21,43.13) v1(40.2,7.37) v1(40.45,4.32) v1(41.72,32.77) v1(42.1,47.88) v1(42.35,38.69) v1(43.41,41.72) v1(43.88,45.07) v1(44.11,30.81) v1(44.11,28.8) v1(44.39,55.63) v1(44.52,35.54) v1(47.18,60.96) v1(47.82,50.67) v1(47.82,47.62) v1(47.82,42.42) v1(47.94,23.24) v1(48.58,9.78) v1(49.09,79.5) v1(49.72,24.38) v1(49.85,45.97) v1(50.25,55.8) v1(50.23,2.8) v1(50.23,0.76) v1(51.42,79.5) v1(51.63,71.12) v1(52.33,9.78) v1(52.64,71.25) v1(53.64,71.25) v1(53.83,79.5) v1(54.67,27.43) v1(54.67,26.03) v1(54.67,24.63) v1(54.67,23.23) v1(54.67,21.83) v1(54.67,20.43) v1(54.67,19.03) v1(54.67,17.63) v1(54.67,16.23) v1(54.67,14.83) v1(54.67,13.43) v1(54.67,12.03) v1(55.69,28.45) v1(55.69,27.05) v1(55.69,25.65) v1(55.69,24.25) v1(55.69,22.85) v1(55.69,21.45) v1(55.69,20.05) v1(55.69,18.65) v1(55.69,17.25) v1(55.69,15.85) v1(55.69,14.45) v1(55.69,13.05) v1(56.2,72.64) v1(56.2,57.66) v1(56.2,55.75) v1(56.2,53.34) v1(56.33,79.5) v1(56.71,29.46) v1(56.71,28.06) v1(56.71,26.66) v1(56.71,25.26) v1(56.71,23.86) v1(56.71,22.46) v1(56.71,21.06) v1(56.71,19.66) v1(56.71,18.26) v1(56.71,16.86) v1(56.71,15.46) v1(56.71,14.06) v1(57.09,71.75) v1(58.61,78.99) v1(59.18,47.66) v1(59.18,45.66) v1(59.18,43.66) v1(59.18,41.66) v1(59.18,39.66) v1(59.18,37.66) v1(59.18,35.66) v1(59.18,33.66) v1(59.18,31.66) v1(59.18,29.66) v1(59.18,27.66) v1(59.18,25.66) v1(59.18,23.66) v1(59.18,21.66) v1(59.18,19.66) v1(59.25,50.55) v1(59.82,17.54) v1(60.01,57.66) v1(60.01,55.59) v1(60.39,77.6) v1(60.39,66.29) v1(60.39,65.54) v1(61.15,53.34) v1(61.28,16) v1(62.04,75.95) v1(62.04,2.2) v1(62.04,0.89) v1(62.42,56.77) v1(62.67,54.86) v1(62.8,65.54) v1(63.06,14.22) v1(64.2,56.51) v1(64.33,65.03) v1(64.33,63.63) v1(65.34,57.78) v1(65.34,11.94) v1(66.23,70.1) v1(66.23,68.14) v1(66.23,65.66) v1(66.99,10.16) v1(69.28,7.87) v1(70.93,3.56)
VBUS: length 18.9
  Top Layer w0.4: PICOUSB.A4B9 39,15.89 39.74,16.62 39.74,19.95 39,20.69 PICOUSB.B4A9
  Top Layer w0.5: PICOUSB.B4A9 37.03,20.69 36.26,21.46 36.26,23.49 35.88,23.88 34.95,23.88 D1.2
  Top Layer w0.6: 35.3,13.84 35.3,14.19 D6.1 36.86,15.24 37.51,15.89 PICOUSB.A4B9
VBUSINESP: length 89.3
  Top Layer w0.25: C34.2 41.62,40.93 42.81,40.93 42.84,40.89 v1(43.5,40.89) 43.09,40.49 U14.9 ; 31.2,53.1 30.63,53.67 30.63,53.86 ; 30.63,53.86 30.63,53.91 v1(30.45,54.09) 30.01,53.66 C35.2 C36.2 27.89,53.92 R28.2 ; 30.63,53.86 30.89,53.6 31.2,53.6
  Top Layer w0.3: v1(48.82,30.69) 48.86,30.69 48.86,31.54 R15.1
  Top Layer w0.75: C32.2 C27.2 43.59,24.98 U15.3 ; 49.82,7.87 49.69,8 v1(48.13,8) v1(47.43,8) 45.28,10.16 D2.1 43.78,8.85 43.05,8.13 ; v1(46.04,23.49) 46.01,23.47 v1(45.15,23.47) 43.83,24.79 U15.3 ; U15.3 v1(43.83,26.12)
  Bottom Layer w0.25: 41.52,37.92 41.52,38.91 v1(43.5,40.89) ; 41.52,37.92 41.52,36.01 46.84,30.69 v1(48.82,30.69) ; 41.52,37.92 39.33,40.11 39.33,46.08 31.32,54.09 v1(30.45,54.09)
  Bottom Layer w0.3: v1(43.83,26.12) 44.25,26.12 v1(48.82,30.69)
  Bottom Layer w0.75: v1(47.43,8) 46.55,8.89 46.55,22.99 v1(46.04,23.49)
#EN: length 92.7
  Top Layer w0.3: Q3.3 45.7,55.2 v1(45.4,55.5) ; R13.1 46.62,5.27 C14.2 44.89,4.05 SW9.2 ; U1.3 26.47,53.81 v1(26.44,53.78)
  Top Layer w0.5: C25.2 46.77,55.94 Q3.3
  Bottom Layer w0.3: SW9.2 43.2,3.53 43.2,4.01 43.99,4.8 43.99,7.18 40.43,10.74 40.43,36.37 38.85,37.95 38.85,45.88 31.25,53.48 26.73,53.48 v1(26.44,53.78) 29.27,53.78 30.49,54.99 44.89,54.99 v1(45.4,55.5)
CAMD0: length 15.3
  Top Layer w0.28: FPC3.6 54.1,64.99 52.81,66.28 45.92,66.28 44.79,65.15 41.72,65.15
CAMD1: length 14.3
  Top Layer w0.28: FPC3.4 53.09,63.06 53.09,64.63 52.42,65.3 46.31,65.3 43.61,62.61 41.72,62.61
CAMD2: length 21.5
  Top Layer w0.3: v1(45.78,58.55) 46,58.33 51.02,58.33 52.6,59.9 FPC3.3 ; U1.12 37.9,57.15 v1(39.31,55.75)
  Bottom Layer w0.3: v1(45.78,58.55) 42.99,55.75 v1(39.31,55.75)
CAMD3: length 14.8
  Top Layer w0.28: 41.72,63.88 44.2,63.88 46.12,65.8 52.61,65.8 53.6,64.81 FPC3.5
CAMD4: length 16.4
  Top Layer w0.28: 41.72,66.42 42.23,66.42 43.01,65.63 44.59,65.63 45.72,66.77 53.01,66.77 54.6,65.18 FPC3.7
CAMD5: length 33.4
  Top Layer w0.28: v1(55.85,64.24) 55.6,63.99 FPC3.9
  Top Layer w0.3: v1(49.85,68.05) 46.84,68.05 45.75,69.15 43.84,69.15 43.23,69.76 v1(43.09,69.76) ; v1(35.28,77.44) 34.2,76.36 34.2,75.91 U1.32
  Bottom Layer w0.3: v1(35.28,77.44) 35.39,77.34 42.05,77.34 43.04,76.35 43.04,69.7 v1(43.09,69.76) ; v1(55.85,64.24) 52.78,67.31 50.59,67.31 v1(49.85,68.05)
CAMD6: length 35.8
  Top Layer w0.28: v1(56.01,65.15) 56.6,64.56 FPC3.11
  Top Layer w0.3: v1(44.09,69.76) 45.85,69.76 46.76,68.84 50.47,68.84 v1(51.24,68.07) ; 32.82,75.81 32.82,76.32 34.55,78.05 36.19,78.05 v1(36.26,77.98)
  Bottom Layer w0.3: v1(36.26,77.98) 36.4,77.84 42.26,77.84 43.54,76.56 43.54,70.3 v1(44.09,69.76) ; v1(51.24,68.07) 52.9,68.07 55.82,65.15 v1(56.01,65.15)
CAMD7: length 28.1
  Top Layer w0.28: v1(57.72,64.52) 57.6,64.52 FPC3.13
  Top Layer w0.3: U1.28 39.17,76.16 39.99,76.98 42.85,76.98 46.26,73.57 v1(46.8,73.57)
  Bottom Layer w0.3: v1(46.8,73.57) 48.12,73.57 48.66,73.02 52.87,73.02 57.68,68.21 57.68,64.56 v1(57.72,64.52)
CAMHREF: length 32.4
  Top Layer w0.28: v1(58.99,64.26) 58.99,63.82 59.08,63.74 59.08,63.07 FPC3.16
  Top Layer w0.3: U1.30 36.63,76.16 38.45,77.98 44.16,77.98 47.9,74.24 v1(47.92,74.24)
  Bottom Layer w0.3: v1(47.92,74.24) 48.15,74.24 48.83,73.56 53.05,73.56 58.18,68.42 58.18,65.07 v1(58.99,64.26)
CAMPCLK: length 22.1
  Top Layer w0.28: FPC3.8 55.1,65.36 54.04,66.42 54.04,67.44 C40.2
  Top Layer w0.3: 41.72,67.69 42.68,67.69 43.19,68.2 43.44,68.2 43.62,68.01 43.62,66.8 43.94,66.48 44.26,66.8 44.26,67.98 44.56,68.28 44.98,67.86 44.98,67.36 45.3,67.04 45.57,67.31 51.63,67.31 C40.2
CAMRST: length 10.8
  Top Layer w0.28: 56.79,68.45 57.18,68.83 58.86,68.83 61.11,66.59 61.11,64.43 60.6,63.93 FPC3.19
  Top Layer w0.8: 56.6,66.87 56.77,67.04 56.77,67.26 56.79,67.29 56.79,68.45
CAMSIOC: length 30.4
  Top Layer w0.3: 41.72,71.5 42.35,71.5 42.74,71.12 45.91,71.12 47.18,69.85 48.82,69.85 R31.1 49.85,70.87 50.31,70.87 52.98,73.54 57.56,73.54 57.98,73.13 57.98,70.42 61.6,66.8 61.6,64.23 61.1,63.73 FPC3.20
CAMSIOD: length 31
  Top Layer w0.3: 41.72,72.77 42.23,72.77 43.24,71.75 45.99,71.75 46.99,70.75 R32.1 48.2,70.75 48.96,71.5 50.23,71.5 52.77,74.04 57.77,74.04 58.48,73.33 58.48,70.65 62.1,67.03 FPC3.22
CAMVSYNC: length 32.2
  Top Layer w0.28: FPC3.18 60.1,63.06 60.1,64.39 v1(60.38,64.67)
  Top Layer w0.3: v1(49.09,74.17) 48.56,73.64 47.59,73.64 43.74,77.48 39.22,77.48 37.9,76.16 U1.29
  Bottom Layer w0.3: v1(60.38,64.67) 58.69,66.36 58.69,68.63 53.15,74.17 v1(49.09,74.17)
CAMXCLK: length 22.3
  Top Layer w0.28: FPC3.12 57.1,64.75 57.07,64.77 v1(57.07,65.07)
  Top Layer w0.3: 41.72,70.23 41.98,70.48 45.83,70.48 46.97,69.35 49.58,69.35 50.47,70.23 v1(51.5,70.23)
  Bottom Layer w0.3: v1(51.5,70.23) 51.63,70.36 54.82,70.36 57.07,68.11 v1(57.07,65.07)
D_N: length 51.9
  Top Layer w0.3: U11.14 56.06,44.33 57.59,42.8 57.59,12.95 55.94,11.3 55.94,9.02 55.45,8.52 ESPUSB.B7 55.45,6.06 55.67,5.84 56.22,5.84 56.45,6.07 56.45,6.79 ESPUSB.A7
D_P: length 52
  Top Layer w0.3: U11.15 56.45,44.83 58.48,42.8 58.48,13.08 56.45,11.04 56.45,7.87 56.58,7.74 ; ESPUSB.A6 55.95,7.52 56.17,7.74 56.58,7.74 ; 56.58,7.74 56.58,7.75 56.72,7.75 56.95,7.52 ESPUSB.B6
DTR: length 17
  Top Layer w0.25: v1(40.42,40.43) 41.55,40.43 41.6,40.38 U14.12 ; v1(43.5,50.3) 44.78,51.58 44.93,51.58
  Top Layer w0.5: Q2.2 44.93,51.58 R24.2
  Bottom Layer w0.25: v1(43.5,50.3) 43.26,50.3 41.34,48.39 41.34,41.62 40.42,40.7 v1(40.42,40.43)
EIO0: length 104.2
  Top Layer w0.3: R14.1 67.11,4.87 66.81,4.57 65.61,4.57 SW10.2 ; 40.44,75.81 40.44,76.15 40.74,76.45 42.35,76.45 45.85,72.96 48.89,72.96 50.48,74.54 57.98,74.54 58.99,73.53 58.99,70.85 63.45,66.39 v1(63.45,66.31)
  Bottom Layer w0.3: SW10.2 65.47,4.43 65.47,10.81 58.1,18.18 58.1,51.43 63.45,56.79 v1(63.45,66.31)
EIO1: length 40.2
  Top Layer w0.3: v1(42.93,61.89) 42.93,58.23 42.13,57.44 42.13,56.75 C26.2 ; v1(27.24,77.22) 26.26,77.22 25.2,76.16 U1.39
  Top Layer w0.5: Q2.3 42.52,56.24 C26.2
  Bottom Layer w0.3: v1(27.24,77.22) 27.62,76.83 41.85,76.83 42.48,76.2 42.48,68.17 42.43,68.12 42.43,62.39 v1(42.93,61.89)
EIO7: length 3.7
  Top Layer w0.25: U1.7 31.81,58.05 31.81,57.66 33.45,56.02 U16.1
EIO15: length 4.9
  Top Layer w0.25: 34.2,54.6 34.47,54.6 34.79,54.92 34.79,56.02 33.08,57.73 33.08,58.05 32.82,58.31
EIO16: length 5.8
  Top Layer w0.25: U1.9 34.09,57.79 35.24,56.64 35.24,54.32 34.52,53.6 34.2,53.6
EIO17: length 50.2
  Top Layer w0.18: U1.10 35.36,57.92 35.75,57.53 35.75,52.69 28.7,45.65 28.35,45.65 28.27,45.57 28.27,45.21 26.18,43.12 19.94,43.12 15.34,38.52 15.34,31.31 18.87,27.78 18.87,24.63 17.07,22.82 17.07,22.82
EIO18: length 50.2
  Top Layer w0.18: U1.11 36.63,57.4 36.13,56.9 36.13,52.59 26.29,42.75 20.21,42.75 15.74,38.28 15.74,31.41 19.24,27.91 19.24,24.42 U7.6
EIO19: length 21
  Top Layer w0.25: v1(43.51,47.89) 39.89,51.51 39.89,56.69 39.17,57.41 U1.13 ; v1(45.37,41.69) 45.05,42.01 45.05,42.31 44.63,42.73 U11.11
  Bottom Layer w0.25: v1(45.37,41.69) 45.37,45.74 43.73,47.38 43.73,47.51 43.73,47.52 43.73,47.88 43.72,47.89 v1(43.51,47.89)
EIO20: length 21.1
  Top Layer w0.25: v1(44.14,48.43) 43.91,48.43 41.3,51.04 41.3,51.15 40.69,51.76 40.69,52.54 40.52,52.72 40.5,52.72 40.32,52.9 40.32,53.04 40.5,53.22 40.52,53.22 40.69,53.4 40.69,53.54 40.52,53.72 40.5,53.72 40.32,53.9 40.32,54.04 40.5,54.22 40.52,54.22 40.69,54.4 40.69,54.54 40.52,54.72 40.5,54.72 40.32,54.9 40.32,55.04 40.5,55.22 40.52,55.22 40.69,55.4 40.69,55.54 40.52,55.72 40.5,55.72 40.32,55.9 40.32,56.04 40.5,56.22 40.52,56.22 40.69,56.4 40.69,58.06 40.44,58.31 ; v1(45.97,42.29) 45.66,42.29 45.13,42.82 U11.12
  Bottom Layer w0.25: v1(45.97,42.29) 45.97,45.72 44.14,47.55 v1(44.14,48.43)
EIORX: length 61.1
  Top Layer w0.25: R22.1 47.83,37.09 v1(48.7,37.97)
  Top Layer w0.3: v1(30.16,77.47) 29.01,76.32 U1.36
  Bottom Layer w0.3: v1(30.16,77.47) 30.27,77.57 34.3,77.57 35.31,78.58 42.64,78.58 44.7,76.53 44.7,61.28 48.53,57.44 48.53,56.93 48.32,56.71 48.14,56.71 47.92,56.5 47.92,56.33 48.14,56.11 48.32,56.11 48.53,55.9 48.53,55.73 48.32,55.51 48.14,55.51 47.92,55.3 47.92,55.13 48.14,54.91 48.32,54.91 48.53,54.7 48.53,38.15 v1(48.7,37.97)
EIOTX: length 61.1
  Top Layer w0.25: v1(49.14,38.92) 47.76,38.92 R23.1
  Top Layer w0.3: v1(29.4,77.98) 27.74,76.32 U1.37
  Bottom Layer w0.3: v1(49.14,38.92) 49.14,57.6 45.24,61.5 45.24,76.74 42.86,79.12 35.14,79.12 34.09,78.08 29.5,78.08 v1(29.4,77.98)
GPIO0: length 41
  Top Layer w0.18: U7.2 18.99,21.91 18.99,22.99 19.95,23.95 19.95,24.12 19.96,24.12 19.96,28.23 19.37,28.83 19.37,29.01 19.52,29.15 19.52,29.33 19.44,29.41 19.26,29.41 19.12,29.26 18.94,29.26 18.86,29.34 18.86,29.52 19.52,30.17 19.52,30.35 19.44,30.43 19.26,30.43 18.61,29.77 18.43,29.77 18.35,29.84 18.35,30.02 19.25,30.92 19.25,31.1 19.18,31.18 19,31.18 18.1,30.28 17.92,30.28 17.84,30.35 17.84,30.53 18.38,31.08 18.38,31.26 18.31,31.33 18.13,31.33 17.59,30.79 17.41,30.79 17.33,30.86 17.33,31.04 17.37,31.08 17.37,31.26 17.29,31.33 17.11,31.33 17.08,31.3 16.9,31.3 16.46,31.73 16.46,37.25 16.67,37.46 17.13,37.46 17.2,37.54 17.2,37.67 16.89,37.98 16.89,38.16 16.96,38.24 17.14,38.24 17.53,37.85 17.83,37.85 17.94,37.95 17.4,38.49 17.4,38.67 17.47,38.74 17.65,38.74 18.3,38.1 18.58,38.1 18.58,38.33 17.91,39 17.91,39.18 17.98,39.25 18.16,39.25 18.81,38.61 18.9,38.61 18.9,39.03 18.42,39.51 18.42,39.69 18.49,39.76 18.67,39.76 19.15,39.28 19.33,39.28 19.41,39.36 19.41,39.54 18.93,40.02 18.93,40.11 19,40.18 19.27,40.18 19.66,39.79 19.84,39.79 19.92,39.87 19.92,40.05 19.43,40.53 19.43,40.71 20,41.27 21.15,41.27
GPIO1: length 41
  Top Layer w0.18: 36.51,41.27 24.94,41.27 23.85,42.37 20.46,42.37 16.12,38.03 16.12,31.57 19.62,28.07 19.62,24.26 18.62,23.26 18.62,22.1 U7.3
GPIO6: length 30.7
  Top Layer w0.18: 14.1,32.25 14.96,31.4 14.96,31.14 18.49,27.61 18.49,24.82 16.78,23.11 U7.8
  Top Layer w0.2: U22.2 9.48,45.64 9.48,40.49 11.31,38.66 12.98,38.66 14.1,37.55 14.1,32.25
GPIO7: length 27.7
  Top Layer w0.2: U22.1 7.52,44.8 9.08,43.25 9.08,40.32 11.14,38.26 12.82,38.26 13.7,37.38 13.7,32.09 14.56,31.22 14.56,30.94 18.1,27.4 18.1,24.98 U7.9
GPIO8: length 22.6
  Top Layer w0.2: U2.2 7.52,41.31 10.98,37.86 12.65,37.86 13.29,37.21 13.29,31.92 14.16,31.05 14.16,30.77 15.43,29.5 15.43,27.27 16.6,26.1 16.6,24.6 15.94,23.94
GPIO9: length 20.6
  Top Layer w0.2: U7.12 16.19,24.77 16.19,25.93 15.03,27.1 15.03,29.33 13.76,30.6 13.76,30.88 12.89,31.75 12.89,37.05 12.48,37.45 9.09,37.45 U2.1
GPIO12: length 16.3
  Top Layer w0.18: U7.15 13.74,25.08 14.84,26.18 v1(15.15,26.18)
  Bottom Layer w0.18: U5.2 7.56,35.48 7.56,34.67 8.49,33.74 8.49,30.69 10.34,28.83 13.12,28.83 15.15,26.81 v1(15.15,26.18)
GPIO13: length 14.5
  Top Layer w0.18: U7.16 12.79,25.18 12.79,25.4 13.43,26.04 14,26.04 14.54,26.57 v1(14.54,26.64)
  Bottom Layer w0.18: v1(14.54,26.64) 14.54,26.88 12.96,28.45 9.97,28.45 7.52,30.89 U5.1
GPIO14: length 11.4
  Top Layer w0.18: v1(13.77,26.58) 13.43,26.58 12.41,25.56 12.41,25 U7.17
  Top Layer w0.2: U4.2 7.52,29.84
  Bottom Layer w0.18: U4.2 8.93,28.07 12.49,28.07 13.77,26.78 v1(13.77,26.58)
GPIO15: length 9.7
  Top Layer w0.18: v1(12.76,26.68) 12.42,26.34 12.42,26.32 12.1,26 12.07,26 12.03,25.95 12.03,24.82 U7.18
  Bottom Layer w0.18: v1(12.76,26.68) 12.76,27.25 12.33,27.69 8.27,27.69 U4.1
GPIO16: length 4.3
  Top Layer w0.2: 10.35,21.4 9.92,21.83 8.08,21.83 7.52,22.39 U24.2
GPIO17: length 3.2
  Top Layer w0.2: U7.28 9.76,21.43 9.17,21.43 8.22,20.48 7.94,20.48 U24.1
GPIO18: length 3.5
  Top Layer w0.2: 7.52,17.4 7.68,17.4 10.06,19.78
GPIO19: length 5.8
  Top Layer w0.2: 10.35,19.49 8.5,17.64 8.5,16.99 7.56,16.05 7.56,14.89 7.52,14.86
GPIO20: length 19.5
  Top Layer w0.18: v1(10.01,18.37) 10.01,18.59 U7.31
  Bottom Layer w0.18: v1(10.01,18.37) 10.01,15.33 12,13.35 12,8.55 SW11.1
MAXVDD: length 213.1
  Top Layer w0.25: U16.4 32,55.4 32,55.47 30.83,56.64 v1(30.8,56.64) 29.53,55.37 R28.1
  Top Layer w0.28: FPC3.14 58.12,63.07 58.12,63.74 58.4,64.02 58.4,64.73 57.34,65.79 56.17,65.79 R30.2
  Top Layer w0.3: 23.56,52.96 23.56,51.43 R21.2 ; 23.56,52.96 C13.2 23.57,53.72 v1(25.21,53.72) ; 23.56,52.96 20.86,50.26 17.37,50.26 16.31,51.32 CN4.3 ; v1(45.53,7.87) 46.67,6.73 47.26,6.73 47.56,6.43 47.56,5.17 48.84,3.89 63.42,3.89 65.12,5.59 R14.2 ; C33.2 42.03,30.95 43.36,30.95 44.25,31.84 44.25,32.68 44.55,32.98 Q1.2 45.42,32.98 45.98,33.54 45.98,34.2 46.28,34.5 46.78,34.5 47.67,35.39
  Top Layer w0.6: R31.2 R32.2 46.86,72.25 v1(46.74,72.14) ; v1(38.54,36.83) 38.54,33.25 40.85,30.95 40.85,30.86 C33.2 C30.2 42.81,28.53 U15.2 42.74,26.43 v1(42.74,26.42) ; C48.1 53.72,49.34 54.42,50.04 U28.3
  Top Layer w0.7: U26.3 58.08,50.02 57.38,49.32 C45.2
  Top Layer w0.75: v1(44.01,58.42) 44.01,61.98 46.61,64.58 v1(46.61,64.59) ; R30.2 55.09,66.97 v1(55.82,67.69) ; C45.2 57.38,48.55 v1(56.32,47.5) 55.05,47.5 53.72,48.83 C48.1
  Top Layer w0.8: C41.2 54.83,67.82 55.09,67.56 55.09,66.97
  Top Layer w0.9: U1.2 25.2,56.51 25.21,56.5 v1(25.21,53.72)
  Bottom Layer w0.3: v1(42.74,26.42) 42.74,23.62 41.54,22.43 41.54,11.86 v1(45.53,7.87)
  Bottom Layer w0.6: v1(38.54,36.83) 38.2,37.18 38.2,45.61 30.98,52.83 26.1,52.83 v1(25.21,53.72)
  Bottom Layer w0.75: v1(56.32,47.5) 55.37,48.46 55.37,55.83 v1(46.61,64.59) 46.74,64.72 46.74,68.65 ; 46.74,68.65 47.05,68.96 54.55,68.96 v1(55.82,67.69) ; 46.74,68.65 v1(46.74,72.14) 45.97,72.91 45.97,73.97 47.07,75.08 51.52,75.08 H8.3 ; v1(25.21,53.72) 26.48,54.99 29.15,54.99 v1(30.8,56.64) 31.18,57.02 42.83,57.02 44.01,58.2 v1(44.01,58.42)
MICSCK: length 22.2
  Top Layer w0.3: 13.81,51.66 13.81,51.27 v1(13.15,50.61) ; U1.5 29.01,57.46 28.09,56.53 27.28,56.53 27.25,56.57 v1(27.17,56.57)
  Bottom Layer w0.3: v1(13.15,50.61) 12.76,51 12.76,51.95 14.03,53.21 21.96,53.21 25.11,56.36 26.97,56.36 v1(27.17,56.57)
MICSD: length 16.8
  Top Layer w0.3: v1(21.27,51.82) 20.22,50.76 18.03,50.76 17.56,51.23 17.56,51.66 ; 30.28,58.31 30.28,57.65 29.44,56.8 v1(29.36,56.8)
  Bottom Layer w0.3: v1(21.27,51.82) 25.32,55.86 28.42,55.86 v1(29.36,56.8)
MICWS: length 20.1
  Top Layer w0.3: v1(27.57,57.24) 27.57,57.71 27.74,57.88 U1.4
  Top Layer w0.5: v1(11.75,51.94) 12.28,51.94 12.56,51.66
  Bottom Layer w0.3: v1(11.75,51.94) 11.76,51.94 13.54,53.72 21.75,53.72 24.9,56.87 26.35,56.87 26.66,57.18 27.51,57.18 v1(27.57,57.24)
MONSCL: length 22.7
  Top Layer w0.3: 30.28,75.81 30.28,76.16 33.21,79.09 36.72,79.09 36.82,78.99 47.82,78.99 H8.2
MONSDA: length 19
  Top Layer w0.3: U1.34 31.55,76.19 33.94,78.58 36.51,78.58 36.61,78.49 46.55,78.49 47.82,77.22 H8.1
NET15: length 22.7
  Top Layer w0.25: U16.9 31.95,51.45 30.23,49.73 12.69,49.73 12,50.42 L1.2
NET16: length 30.6
  Top Layer w0.25: U16.10 32.45,52.34 32.45,51.31 30.41,49.27 4.32,49.27 L2.2
PWDN: length 2.6
  Top Layer w0.25: FPC3.17 59.6,65.19 59.25,65.54
QSPI_SCLK: length 7.4
  Top Layer w0.18: U6.6 22.92,16.26 22.88,16.21 20.09,16.21 17.66,18.64 U7.52
QSPI_SD0: length 5.5
  Top Layer w0.18: U6.5 21.65,16.59 20.25,16.59 U7.53
QSPI_SD1: length 11.7
  Top Layer w0.18: U6.2 24.19,23.74 23.43,24.51 21.42,24.51 20.78,23.87 20.78,20.08 19.77,19.07 18.9,19.07 U7.55
QSPI_SD2: length 7.2
  Top Layer w0.18: U7.54 18.72,18.69 19.93,18.69 22.92,21.68 U6.3
QSPI_SD3: length 9.2
  Top Layer w0.18: U7.51 19.88,15.83 23.76,15.83 24.19,16.26 U6.7
QSPI_SS: length 13.1
  Top Layer w0.18: U6.1 25.46,23.88 24.45,24.89 24.07,24.89 23.81,25.15 23.18,25.15 22.93,24.89 21.26,24.89 20.4,24.03 20.4,20.24 19.61,19.46 19.08,19.46 U7.56
RTS: length 21.9
  Top Layer w0.25: v1(42.7,50.58) 42.7,50.8 R25.2 ; v1(39.91,41.12) 39.84,41.04 39.84,40.19 40.58,39.44 U14.13
  Top Layer w0.5: v1(42.74,52.58) 42.74,52.34 R25.2 ; Q3.2 47.41,52.58 v1(47.92,52.58)
  Bottom Layer w0.25: v1(42.7,50.58) 42.7,50.39 40.89,48.57 40.89,42.09 v1(39.91,41.12)
  Bottom Layer w0.5: v1(42.74,52.58) v1(47.92,52.58)
RUN: length 24.4
  Top Layer w0.16: v1(9.19,22.39) 9.91,22.39 10.61,21.68 U7.26
  Top Layer w0.18: SW2.2 9.91,32.44 9.59,32.12 v1(9.59,30.61)
  Bottom Layer w0.16: v1(9.19,22.39) 11.95,25.15 14.92,25.15 15.68,25.91 15.68,26.8 13.27,29.21 10.99,29.21 v1(9.59,30.61)
USB2_N: length 4.1
  Top Layer w0.25: U14.8 43.93,39.44 44.14,39.66 44.14,41.94 43.63,42.45 U11.9
USB2_P: length 4.9
  Top Layer w0.25: U11.10 44.13,42.59 44.59,42.13 44.59,39.25 44.28,38.94 U14.7
USB_DM: length 26.8
  Top Layer w0.18: U7.46 16.54,16.34 18.26,16.34 19.62,14.99 29.15,14.99 31.69,17.53 38.99,17.53 39.25,17.79 39.25,18.29 39,18.54 PICOUSB.A7
USB_DP: length 26.6
  Top Layer w0.18: PICOUSB.A6 37.28,18.04 37.27,18.03 ; PICOUSB.B6 37.71,19.04 37.27,18.6 37.27,18.03 ; 37.27,18.03 34.88,18.03 34.63,18.29 34.52,18.29 34.27,18.03 34.16,18.03 33.91,18.29 33.8,18.29 33.55,18.03 33.44,18.03 33.19,18.29 33.08,18.29 32.83,18.03 32.72,18.03 32.47,18.29 32.36,18.29 32.11,18.03 31.69,18.03 29.1,15.44 19.73,15.44 18.47,16.7 16.75,16.7 U7.47
V+: length 62.8
  Top Layer w2: D7.1 20.52,10.68 19.24,9.4 C3.1 9.97,9.4 5.02,14.35 5.02,14.82 4.98,14.86 ; 9.72,47.25 C21.1
  Top Layer w2.5: 4.98,14.86 U24.4 U24.3 U4.4 U4.3 U5.4 U5.3 U2.4 U2.3 U22.4 U22.3
  Bottom Layer w1.6: U22.3 6.66,49.28 8.3,49.28 9.72,47.86 v1(9.72,47.25)
VSYS: length 12.3
  Top Layer w0.5: 36.51,26.03 36.89,26.03 35.75,24.89 33.78,24.89 C1.2 33.08,22.8 U8.3 33.49,21.78 D1.1 34.33,19.88 U8.1
XI: length 15.1
  Top Layer w0.25: 33.2,44.2 34.86,42.54 40.58,42.54 41.13,43.1 41.13,44.58 41.38,44.83 41.87,44.83 U11.4 ; 33.2,44.2 C18.1 ; 33.2,44.2 R19.2 ; 33.2,44.2 35.14,44.2 U12.1
XO: length 13
  Top Layer w0.25: U11.3 41.32,45.33 38.11,48.55 36.19,48.55 R18.2 35.32,48.01 33.85,48.01 R19.1
$1N1870: length 12
  Top Layer w0.18: 19.43,36.64 19.62,36.45 19.62,31.35 21.12,29.84 21.67,29.84 23.3,28.21 23.3,26.8 23.43,26.67
$1N1872: length 8.9
  Top Layer w0.17: X1.3 11.04,30.16 10.76,29.88 10.76,26.51 10.8,26.48 10.8,24.35 U7.21
$1N1873: length 5.8
  Top Layer w0.17: X1.1 12.06,27.95 11.81,27.95 11.26,27.4 11.26,24.45 U7.20
$1N1896: length 2.2
  Top Layer w0.18: 12.03,13.06 12.43,13.46 13.21,13.46 13.81,14.06
$1N1897: length 4.2
  Top Layer w0.18: U7.37 11.87,17.06 11.87,16.76 12.13,16.51 12.13,15.75 11.11,14.73 11.11,14.27 10.96,14.12
$1N2181: length 2.3
  Top Layer w0.3: PICOUSB.B5 37.3,20.04 R12.2
$1N2182: length 2.1
  Top Layer w0.3: PICOUSB.A5 36.73,17.04 R11.2
$1N3810: length 3.2
  Top Layer w0.3: Q1.1 46.61,32.03 46.67,31.96 46.67,33.61
$1N3984: length 5.5
  Top Layer w0.3: Q1.6 43.55,32.03 43.75,32.22 43.75,32.98 44.69,33.93 Q1.3 45.14,34.18 46.26,35.3 46.16,35.39
$1N4724: length 4.2
  Top Layer w0.25: R18.1 37.59,47.24 U12.3 39.26,46.15 C19.1
$1N5316: length 2.1
  Top Layer w0.3: LED3.1 26.01,50.67 R21.1
$1N6114: length 4.1
  Top Layer w0.25: 43.1,37.5 43.1,36.95 43.35,36.7 43.75,36.7 44.51,37.46 46,37.46 46.17,37.29
$1N6119: length 2.7
  Top Layer w0.25: R23.2 45.28,37.94 U14.5
$1N6176: length 3.7
  Top Layer w0.25: U14.6 44.76,38.44 45.14,38.82 45.14,39.56 C24.2
$1N6413: length 2.2
  Top Layer w0.5: Q3.1 45.28,53 R24.1
$1N6452: length 1.6
  Top Layer w0.5: Q2.1 41.98,52.63 R25.1
$1N6986: length 9.8
  Top Layer w0.6: v1(58.61,7.94) 58.61,7.59 58.6,7.58 58.6,6.79
  Top Layer w0.65: ESPUSB.A4B9 53.77,6.81 53.77,7.89 v1(53.48,8.19) 53.29,8 51.66,8
  Bottom Layer w0.65: v1(58.61,7.94) 58.36,8.19 v1(53.48,8.19)
$1N7041: length 2.7
  Top Layer w0.3: 54.94,6.79 54.94,9.05 54.6,9.4
$1N7109: length 2.5
  Top Layer w0.3: 58.1,9.22 57.95,9.06 ESPUSB.B5
$1N7689: length 1.9
  Top Layer w0.5: LED1.2 28.88,23.45 R8.1
$1N13425: length 5.6
  Top Layer w0.5: C38.2 7.2,50.58 7.2,50.39 7.51,50.08 9.44,50.08 L1.1
  Top Layer w0.75: CN1.1 5.73,52.05 C38.2
$1N13429: length 3.2
  Top Layer w0.75: CN1.2 2.88,50.93 C37.2 2.54,49.66 L2.1
$1N57692: length 28.4
  Top Layer w0.75: D2.2 40.7,10.16 39.85,9.3 34.86,9.3 SW12.2 31.05,13.11 31.05,14.73 31.56,15.24 D6.2
  Top Layer w2: D7.2 27.38,5.88 SW12.2
$1N57698: length 34
  Top Layer w2: U25.1 54.67,30.32 52.51,28.16 52.51,17.53 47.18,12.19 38.49,12.19 SW12.1

## Copper pours and planes (outline as drawn; the poured copper is in the pictures)
GND on Top Layer: outline of 232 points within -11.41,-16.68 93.58,88.31
GND on Bottom Layer: outline of 232 points within -13.06,-13.76 91.93,91.23

## Text on the board
Top Silkscreen Layer: CALIBRATE | TXD | CLK | MISO | MOSI | 3V3 | GND | 5V | 6 | 8 | 9 | 12 | 13 | 14 | 15 | 18 | 19 | 7 | 16 | 17 | WS | SCK | SD | SCL | RXD | SDA | D2 | D1 | D0 | RST | GROVE / VISION AI / MODULE V2 | RESET | BOOT | USB | OFF | ON | V+ | V1.1 | COGNOG
